# Altium schematic sheet WiFi.SchDoc
size 420 x 297 mm; DocumentNumber: 5; SheetNumber: 5; SheetTotal: 5; Обозначение_Код: RIG-00.00.001 Э3
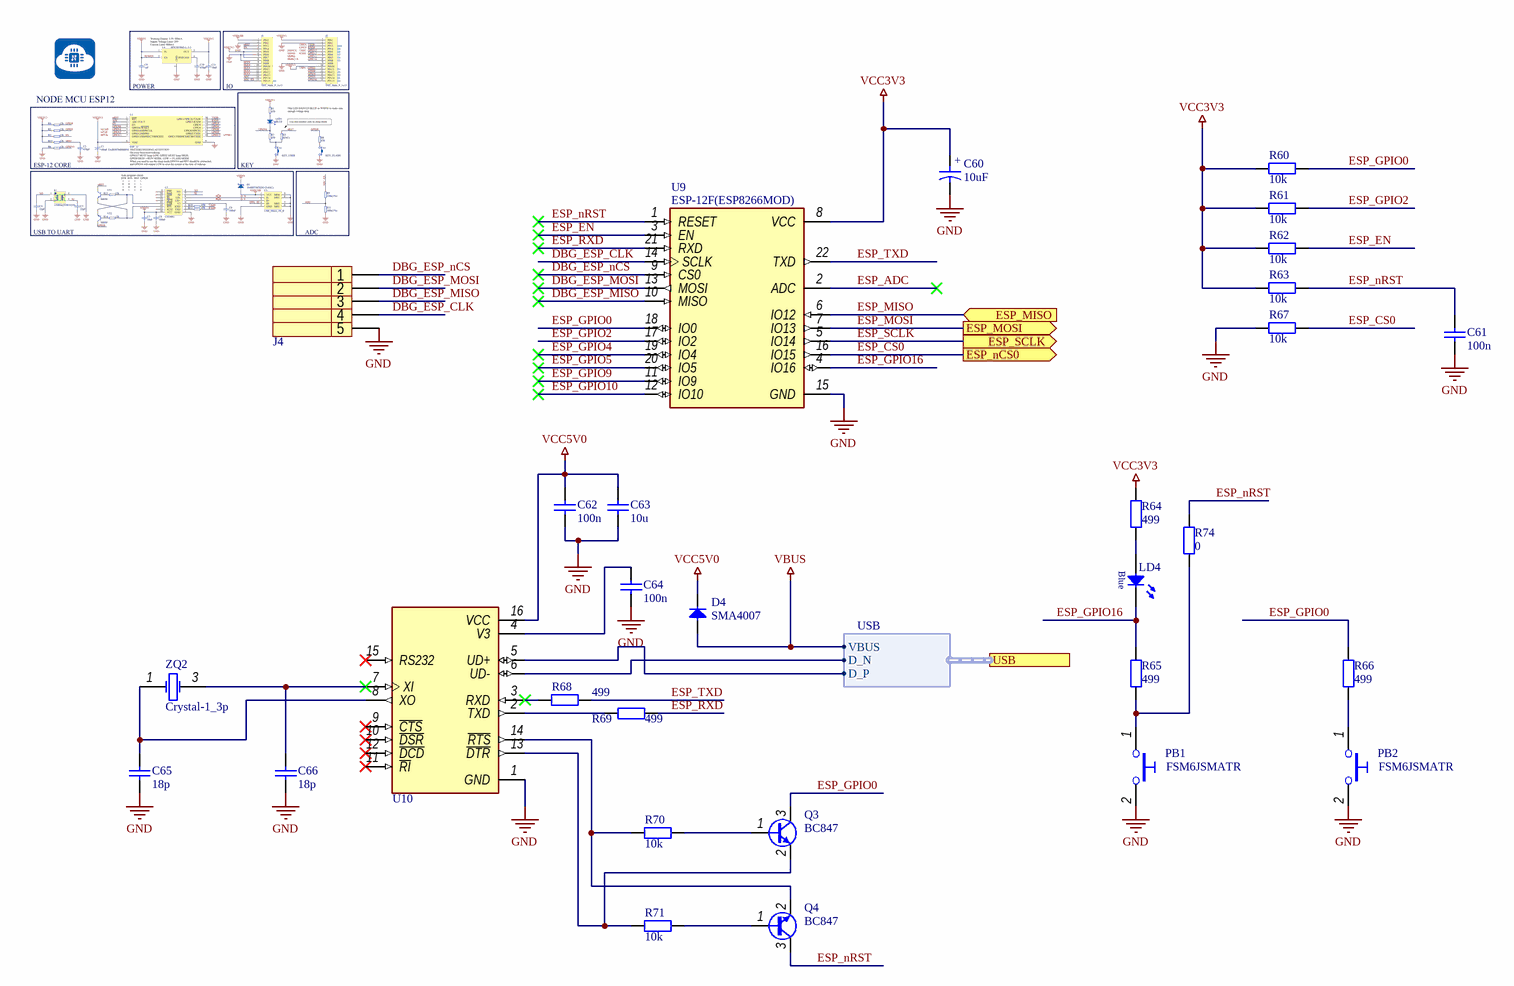
[diagram p0: WiFi.SchDoc]

## Parts
C60  10uF  [CAPPM7343X310N]
C61  100n  [CAPC1005X55N]
C62  100n  [CAPC1005X55N]
C63  10u  [CAPC2012X135N]
C64  100n  [CAPC1005X55N]
C65  18p  [CAPC1005X55N]
C66  18p  [CAPC1005X55N]
D4  SMA4007  [DO-214AC]
J4  DS1021-1*5SF11-B  [PLS-5]  (value not drawn)
LD4  Blue  [0603(LED)]  (value not drawn)
PB1  FSM6JSMATR  [FSMxJSMA-Series]
PB2  FSM6JSMATR  [FSMxJSMA-Series]
Q3  BC847  [SOT95P240X130-3N]
Q4  BC847  [SOT95P240X130-3N]
R60  10k  [RESC1005X40N]
R61  10k  [RESC1005X40N]
R62  10k  [RESC1005X40N]
R63  10k  [RESC1005X40N]
R64  499  [RESC1005X40N]
R65  499  [RESC1005X40N]
R66  499  [RESC1005X40N]
R67  10k  [RESC1005X40N]
R68  499  [RESC1005X40N]
R69  499  [RESC1005X40N]
R70  10k  [RESC1005X40N]
R71  10k  [RESC1005X40N]
R74  0  [RESC1608X50N]
U9  ESP-12F(ESP8266MOD)  [XCVR_ESP8266-12E/ESP-12E]
U10  CH340G  [SOIC127P600X180-16N]  (value not drawn)
ZQ2  Crystal-1_3p  [SMD 3.2x2.5mm]

## Ports
ESP_MISO (in), ESP_MOSI (out), ESP_nCS0 (out), ESP_SCLK (out), USB (harness USB)

## Harnesses
USB: D_N, D_P, VBUS

## Nets
GND: C60.2 C61.1 C62.1 C63.1 C64.1 C65.1 C66.1 J4.5 PB1.2 PB2.2 R67.1 U9.15(GND) U10.1(GND)
VBUS: D4.1(A) ; port USB.VBUS
VCC3V3: C60.1 R60.1 R61.1 R62.1 R63.1 R64.2 U9.8(VCC)
VCC5V0: C62.2 C63.2 D4.2(C) U10.16(VCC)
DBG_ESP_CLK: J4.4 U9.14(SCLK)
DBG_ESP_MISO: J4.3 U9.10(MISO)
DBG_ESP_MOSI: J4.2 U9.13(MOSI)
DBG_ESP_nCS: J4.1 U9.9(CS0)
ESP_ADC: U9.2(ADC)
ESP_CS0: R67.2 U9.16(IO15) ; port ESP_nCS0
ESP_EN: R62.2 U9.3(EN)
ESP_GPIO0: Q3.3(C) R60.2 R66.2 U9.18(IO0)
ESP_GPIO2: R61.2 U9.17(IO2)
ESP_GPIO4: U9.19(IO4)
ESP_GPIO5: U9.20(IO5)
ESP_GPIO9: U9.11(IO9)
ESP_GPIO10: U9.12(IO10)
ESP_GPIO16: LD4.2(C) R65.1 U9.4(IO16)
ESP_MISO: U9.6(IO12) ; port ESP_MISO
ESP_MOSI: U9.7(IO13) ; port ESP_MOSI
ESP_nRST: C61.2 Q4.3(C) R63.2 R74.1 U9.1(RESET)
ESP_RXD: R69.2 U9.21(RXD)
ESP_SCLK: U9.5(IO14) ; port ESP_SCLK
ESP_TXD: R68.2 U9.22(TXD)
NetC64_2: C64.2 U10.4(V3)
NetC65_2: C65.2 U10.8(XO) ZQ2.1(OSC1)
NetC66_2: C66.2 U10.7(XI) ZQ2.3(OSC2)
NetLD4_1: LD4.1(A) R64.1
NetPB1_1: PB1.1 R65.2 R74.2
NetPB2_1: PB2.1 R66.1
NetQ3_1: Q3.1(B) R70.2
NetQ3_2: Q3.2(E) R71.1 U10.13(~{DTR})
NetQ4_1: Q4.1(B) R71.2
NetQ4_2: Q4.2(E) R70.1 U10.14(~{RTS})
NetR68_1: R68.1 U10.3(RXD)
NetR69_1: R69.1 U10.2(TXD)
NetU10_5: U10.5(UD+) ; port USB.D_P
NetU10_6: U10.6(UD-) ; port USB.D_N

Not connected (* = marked no-connect by the designer): U10 9(~{CTS})* 10(~{DSR})* 11(~{RI})* 12(~{DCD})* 15(RS232)*

## Notes on the sheet
- Подп. дата
- Инв. № дубл.
- Взам. инв. №
- Подп. и дата
- Инв. № подл.
- Изм.
- Лист
- № докум.
- Подп.
- Дата
- ALTIUM GOSTBOM2.0 KEV
- Файл:
- Копировал
- Формат А3
- (in symbol T491D106K035AT) +

## Library data of the parts
C60 = T491D106K035AT: CAP TANT T491D106K035AT 10uF 35V Tantalum; Manufacturer: KEMET; ID: 2; Tolerance: ±10%; Type: Resistor; Packaging Type: Cut Tape; Working Temperature Min: -55°C; Working Temperature Max: +125°C; Table: Capacitor SMT - Электролитические; Part Number: T491D106K035AT; Device: T491D106K035AT; Value: 10uF; Voltage: 35V; Dielectric Type: Tantalum; Series: T491; SMD: Yes; Manufacturer Part Number: T491D106K035AT; Datasheet URL: #https://datasheet.lcsc.com/lcsc/2304140030_KEMET-T491D106K035AT_C122299.pdf#; Status: Active; Price: 0; Price2: 0; Price3: 0; Author: Krepak V.; CreateDate: 20.02.2024
C61 = GRM155R71C104KA88D: CAP CER 0402 100n 16V X7R; Manufacturer: Murata; ID: 3; Device: 0402; Tolerance: 10%; Type: Resistor; Packaging Type: Cut Tape; Working Temperature Min: -55°С; Working Temperature Max: +125°С; Table: Capacitor SMT - Керамические; Part Number: GRM155R71C104KA88D; Value: 100n; Voltage: 16V; Dielectric Type: X7R; Series: GRM; SMD: Yes; Manufacturer Part Number: GRM155R71C104KA88D; Status: Active; Price: 0; Price2: 0; Price3: 0; Author: Krepak V.; CreateDate: 23.02.2020
C62 C64 = GRM155R71E104KE14D: CAP CER 0402 100n 25V X7R; Manufacturer: Murata; ID: 4; Device: 0402; Tolerance: 10%; Type: Resistor; Packaging Type: Cut Tape; Working Temperature Min: -55°С; Working Temperature Max: +125°С; Table: Capacitor SMT - Керамические; Part Number: GRM155R71E104KE14D; Value: 100n; Voltage: 25V; Dielectric Type: X7R; Series: GRM; SMD: Yes; Manufacturer Part Number: GRM155R71E104KE14D; Status: Active; Price: 0; Price2: 0; Price3: 0; Author: Krepak V.; CreateDate: 23.02.2020
C63 = GRM21BZ71E106KE15L: CAP CER 0805 10u 25V X7R; Manufacturer: Murata; ID: 5; Device: 0805; Tolerance: 10%; Type: Resistor; Packaging Type: Cut Tape; Working Temperature Min: -55°С; Working Temperature Max: +125°С; Table: Capacitor SMT - Керамические; Part Number: GRM21BZ71E106KE15L; Value: 10u; Voltage: 25V; Dielectric Type: X7R; Series: GRM; SMD: Yes; Manufacturer Part Number: GRM21BZ71E106KE15L; Status: Active; Price: 0; Price2: 0; Price3: 0; Author: Krepak V.; CreateDate: 23.02.2020
C65 C66 = C0402C180K5RACTU: CAP CER 0402 18p 50V X7R; Manufacturer: Kemet; Manufacturer Part Number: C0402C180K5RAC7867; ID: 9; Device: 0402; Tolerance: 10%; Type: Resistor; Packaging Type: Cut Tape; Working Temperature Min: -55°С; Working Temperature Max: +125°С; Table: Capacitor SMT - Керамические; Part Number: C0402C180K5RACTU; Value: 18p; Voltage: 50V; Dielectric Type: X7R; Series: C Series KEMET; SMD: Yes; Status: Active; Price: 0; Price2: 0; Price3: 0; Author: Krepak V.; CreateDate: 25.02.2020
D4 = SMA4007: DIODE SMA4007; Manufacturer: Wing Shing; ID: 1; Value: 1000V; Max Reverse Voltage: 1000VDC; Average Current: 1A; Forward Voltage: 1.1V @ 1.0A DC; Peak Pulse Current: 30A; Reverse Leakage Current: 5uA @ 25°С 1000V; Speed: Standard Recovery; Capacitance: 15pF @ 4V, 1MHz; Reverse Recovery Time: 2.5µs; Packaging Type: Cut Tape; Replacement: 1N4007FLTR, M7, S1MB-13; Working Temperature Min: -65°С; Working Temperature Max: +165°С (JT); Table: Diodes SMT - Общ; Part Number: SMA4007; Device: SMA4007; Type: Diode; SMD: Yes; Manufacturer Part Number: SMA4007; ComponentHeight: 0.96mm; Datasheet URL: #http://pdf.datasheet.live/c12a47ed/wingshing.com/SMA4007.pdf#; Status: Active; Distributor: Chipdip; Price: 0; Price2: 0; Price3: 0; DistributorURL: #https://www.chipdip.ru/product/sma4007#; Author: Krepak V.; CreateDate: 24.06.2020; LatestRevisionDate: 24.06.2020
J4 = DS1021-1*5SF11-B: Manufacturer: CONNFLY; ID: 12; Limit Voltage: 500 V AC (1 min); Resistance: 20 mOhm(max); Pitch: 2.54mm; Working Temperature Min: -20; Working Temperature Max: +70°С; Table: Connectors - Общ; Part Number: DS1021-1*5SF11-B; Device: PLS-5; Pins: 5; Type: Connector; SMD: No; Datasheet URL: #https://static.chipdip.ru/lib/227/DOC000227157.pdf#; Status: Active; Price: 0; Price2: 0; Price3: 0; Author: Arshanitsa D.; CreateDate: 09.06.2020
LD4 = TO-1608BC-BF: DIODE TO-1608BC-BF; Manufacturer Part Number: 9201T055; ID: 1; Packaging Type: Cut Tape; Table: Diodes SMT - Светодиоды; Part Number: TO-1608BC-BF; Device: TO-1608BC-BF; Value: TO-1608BC-BF; Color: Blue; Type: Diode; SMD: Yes; Datasheet URL: #https://static.chipdip.ru/lib/736/DOC002736042.pdf#; Price: 0; Price2: 0; Price3: 0; Author: Arshanitsa D.; CreateDate: 28.06.2020
PB1 PB2 = FSM6JSMATR: Tactile Switch SPST-NO Top Actuated Surface Mount; Manufacturer: Te Connectivity; ID: 3; Device: TACT; Limit Voltage: 24VDC; Limit Current: 50mA; Working Temperature Min: -35°С; Working Temperature Max: +85°С; Table: Misc - Переключатели Кнопочные; Part Number: FSM6JSMATR; Series: FSMJSM; Type: Misc; SMD: Yes; Manufacturer Part Number: FSM6JSMATR; Datasheet URL: #https://www.terraelectronica.ru/pdf/show?pdf_file=http%253A%252F%252Fwww.farnell.com%252Fcad%252F1922404.pdf#; Status: Active; Distributor: terraelectronica; Price: 0; Price2: 0; Price3: 0; DistributorURL: #https://www.terraelectronica.ru/product/972320#; Author: Krepak V.; CreateDate: 31.08.2020
Q3 Q4 = BC847,215: Bipolar (BJT) Transistor NPN 45V 100mA 100MHz 250mW Surface Mount TO-236AB; Manufacturer: Nexperia; ID: 3; Vce Saturation: 400mV @ 5mA, 100mA; Collector Current Cutoff: 15nA (ICBO); DC Current Gain (Min): 110 @ 2mA, 5V; Packaging Type: Tape&Reel; Working Temperature Min: -40°С; Working Temperature Max: +150°С (JT); Table: Transistor SMT - BJT; Part Number: BC847,215; Device: NPN; Series: Automotive, AEC-Q101; Max Collector Current: 100mA; Vce Breakdown: 45V; Total Power Dissipation: 250mW; Frequency - Transition: 100MHz; Type: Transistor; SMD: Yes; Manufacturer Part Number: BC847,215; Datasheet URL: #https://static.chipdip.ru/lib/583/DOC001583029.pdf#; Datasheet Version: Rev. 9 — 23 September 2014; Status: Active; Price: 0; Price2: 0; Price3: 0; Author: Krepak V.; CreateDate: 18.08.2020; LatestRevisionDate: 18.08.2020; Supplier 1: Digikey; Supplier Part Number 1: 1727-4855-2-ND
R60-R63 R67 R70 R71 = RC0402FR-0710KL: RES 0402 10k 1%; Manufacturer: Yageo; ID: 9; Device: 0402; Limit Voltage: 50V; Temperature Coefficient: 100ppm; Total Power Dissipation: 0.0625W; Packaging Type: Cut Tape; Replacement: CR-02FL6---10K; Library Ref 2: Resistor2; Library Ref 3: Resistor3; Library Path 2: Resistors.SchLib; Application Category: 1; Working Temperature Min: -55°С; Working Temperature Max: +155°С; Table: Resistor SMT - Постоянные; Part Number: RC0402FR-0710KL; Value: 10k; Tolerance: 1%; Series: RC; Type: Resistor; Material: Thick-Film; SMD: Yes; Manufacturer Part Number: RC0402FR-0710KL; Datasheet URL: #https://www.terraelectronica.ru/pdf/show?pdf_file=%252Fds%252Fpdf%252FR%252FRC0402.pdf#; Price: 0; Price2: 0; Price3: 0; Author: Krepak V.; CreateDate: 26.02.2020
R64-R66 R68 R69 = RC0402FR-07499RL: RES 0402 499 1%; Manufacturer: Yageo; ID: 90; Device: 0402; Limit Voltage: 50V; Temperature Coefficient: 100ppm; Total Power Dissipation: 0.0625W; Packaging Type: Tape&Reel; Library Ref 2: Resistor2; Library Ref 3: Resistor3; Library Path 2: Resistors.SchLib; Application Category: 1; Working Temperature Min: -55°С; Working Temperature Max: +155°С; Table: Resistor SMT - Постоянные; Part Number: RC0402FR-07499RL; Value: 499; Tolerance: 1%; Series: RC_L; Type: Resistor; Material: Thick-Film; SMD: Yes; Manufacturer Part Number: RC0402FR-07499RL; Datasheet URL: #https://www.yageo.com/upload/media/product/productsearch/datasheet/rchip/PYu-RC_Group_51_RoHS_L_11.pdf#; Status: Active; Distributor2: Jul. 7, 2020 V.11; Price: 0; Price2: 0; Price3: 0; Author: Krepak V.; CreateDate: 01.02.2022; Supplier 1: Digikey; Supplier Part Number 1: 311-499LRTR-ND
R74 = RC0603JR-070RL: RES 0603 0 5%; Manufacturer: Yageo; ID: 25; Device: 0603; Limit Voltage: 50V; Temperature Coefficient: 100ppm; Total Power Dissipation: 0.063W; Packaging Type: Cut Tape; Library Ref 2: Resistor2; Library Ref 3: Resistor3; Library Path 2: Resistors.SchLib; Application Category: 1; Working Temperature Min: -55°С; Working Temperature Max: +155°С; Table: Resistor SMT - Постоянные; Part Number: RC0603JR-070RL; Value: 0; Tolerance: 5%; Series: RC; Type: Resistor; Material: Thick-Film; SMD: Yes; Manufacturer Part Number: RC0603JR-070RL; Datasheet URL: #https://static.chipdip.ru/lib/788/DOC004788200.pdf#; Status: Active; Price: 0; Price2: 0; Price3: 0; Author: Arshanitsa D.; CreateDate: 28.06.2020
U9 = ESP8266MOD: -90dBm 16dBm ESP8266芯片 板载PCBAntenna 2.4GHz SMD,16x24mm WiFi Modules ROHS; MF: AI-Thinker; ID: 10; Working Temperature Min: -40°С; Working Temperature Max: +85°С; Table: Modules - Радиотрансиверы; SnapEDA_Link: https://www.snapeda.com/parts/ESP8266-12E/ESP-12E/AI-Thinker/view-part/?ref=snap; Availability: Not in stock; Price: 0; Package: None; Check_prices: https://www.snapeda.com/parts/ESP8266-12E/ESP-12E/AI-Thinker/view-part/?ref=eda; MP: ESP8266-12E/ESP-12E; Part Number: ESP8266MOD; Device: ESP-12F(ESP8266MOD); RF Family/Standard: WiFi; Type: Misc; SMD: Yes; Status: Active; Price2: 0; Price3: 0; Author: Krepak V.; CreateDate: 04.04.2024
U10 = CH340G: 2Mbps Transceiver USB 2.0 SOP-16 USB ICs ROHS; MF: WCH; ID: 29; Table: IC - Микросхемы интерфейсов; SnapEDA_Link: https://www.snapeda.com/parts/Ch340G/WCH/view-part/?ref=snap; MP: Ch340G; Check_prices: https://www.snapeda.com/parts/Ch340G/WCH/view-part/?ref=eda; Availability: Not in stock; Price: 0; Package: None; Part Number: CH340G; Device: CH340G; Type: IC; SMD: Yes; Price2: 0; Price3: 0; Author: Krepak V.; CreateDate: 05.04.2024
ZQ2 = KX-7 16.0 MHz: Кварцевый резонатор 16.0МГц в корпусе SMD. Размер 3,2х2,5х1,2, Температурный диапазон: -20/+70С Стабильность частоты +/- 30ррm.; ID: 1; Output Frequency: 16MHz; Table: Crystal SMT - Кварцевые Резонаторы; Part Number: KX-7 16.0 MHz; Type: Crystal; SMD: Yes; Distributor: terraelectronica; Price: 0; Price2: 0; Price3: 0; DistributorURL: #https://www.terraelectronica.ru/product/165772#